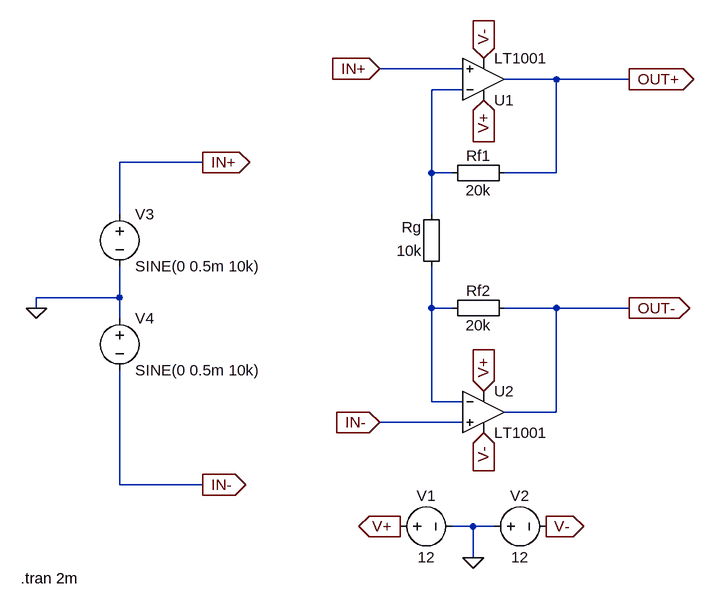
[diagram p0: schematic Biosignal_nachgebaut_Salhofer.asc]
Biosignal_nachgebaut_Salhofer.asc, the LTspice schematic file:
Version 4
SHEET 1 880 768
WIRE 0 -32 -128 -32
WIRE 144 -16 64 -16
WIRE 256 -16 144 -16
WIRE 0 0 -48 0
WIRE -400 112 -528 112
WIRE -48 128 -48 0
WIRE -16 128 -48 128
WIRE 144 128 144 -16
WIRE 144 128 64 128
WIRE -528 192 -528 112
WIRE -48 192 -48 128
WIRE -528 320 -528 272
WIRE -528 320 -656 320
WIRE -656 336 -656 320
WIRE -48 336 -48 272
WIRE -16 336 -48 336
WIRE 144 336 64 336
WIRE 256 336 144 336
WIRE -528 352 -528 320
WIRE -48 480 -48 336
WIRE 0 480 -48 480
WIRE 144 496 144 336
WIRE 144 496 64 496
WIRE 0 512 -128 512
WIRE -528 608 -528 432
WIRE -400 608 -528 608
WIRE 16 672 -16 672
WIRE 48 672 16 672
WIRE 16 720 16 672
FLAG 32 16 V+
IOPIN 32 16 In
FLAG 32 -48 V-
IOPIN 32 -48 In
FLAG 32 528 V-
IOPIN 32 528 In
FLAG 32 464 V+
IOPIN 32 464 In
FLAG -128 -32 IN+
IOPIN -128 -32 In
FLAG -128 512 IN-
IOPIN -128 512 In
FLAG 16 720 0
FLAG -96 672 V+
IOPIN -96 672 Out
FLAG 128 672 V-
IOPIN 128 672 Out
FLAG 256 336 OUT-
IOPIN 256 336 Out
FLAG 256 -16 OUT+
IOPIN 256 -16 Out
FLAG -656 336 0
FLAG -400 608 IN-
IOPIN -400 608 Out
FLAG -400 112 IN+
IOPIN -400 112 Out
SYMBOL Opamps\\LT1001 32 48 M180
SYMATTR InstName U1
SYMBOL Opamps\\LT1001 32 432 R0
SYMATTR InstName U2
SYMBOL Misc\\EuropeanResistor 80 112 R90
WINDOW 0 5 56 VBottom 2
WINDOW 3 27 56 VTop 2
SYMATTR InstName Rf1
SYMATTR Value 20k
SYMBOL Misc\\EuropeanResistor 80 320 R90
WINDOW 0 5 56 VBottom 2
WINDOW 3 27 56 VTop 2
SYMATTR InstName Rf2
SYMATTR Value 20k
SYMBOL Misc\\EuropeanResistor -32 288 R180
WINDOW 0 31 76 Left 2
WINDOW 3 31 40 Left 2
SYMATTR InstName Rg
SYMATTR Value 10k
SYMBOL voltage -112 672 R270
WINDOW 0 32 56 VTop 2
WINDOW 3 -32 56 VBottom 2
SYMATTR InstName V1
SYMATTR Value 12
SYMBOL voltage 32 672 R270
WINDOW 0 32 56 VTop 2
WINDOW 3 -32 56 VBottom 2
SYMATTR InstName V2
SYMATTR Value 12
SYMBOL voltage -528 176 R0
WINDOW 123 0 0 Left 0
WINDOW 39 0 0 Left 0
SYMATTR InstName V3
SYMATTR Value SINE(0 0.5m 10k)
SYMBOL voltage -528 336 R0
WINDOW 123 0 0 Left 0
WINDOW 39 0 0 Left 0
SYMATTR InstName V4
SYMATTR Value SINE(0 0.5m 10k)
TEXT -680 752 Left 2 !.tran 2m

The netlist it stands for:
* Biosignal_nachgebaut_Salhofer.asc
XU1 IN+ N001 V+ V- OUT+ LT1001  ; pins In+ In- V+ V- OUT
XU2 IN- N002 V+ V- OUT- LT1001  ; pins In+ In- V+ V- OUT
Rf1 OUT+ N001 20k
Rf2 OUT- N002 20k
Rg N002 N001 10k
V1 V+ 0 12
V2 0 V- 12
V3 IN+ 0 SINE(0 0.5m 10k)
V4 0 IN- SINE(0 0.5m 10k)
.tran 2m
.lib LTC.lib
.backanno
.end